# Altium schematic sheet [2]TSAL.SchDoc
size A4; SheetNumber: 4; SheetTotal: 7
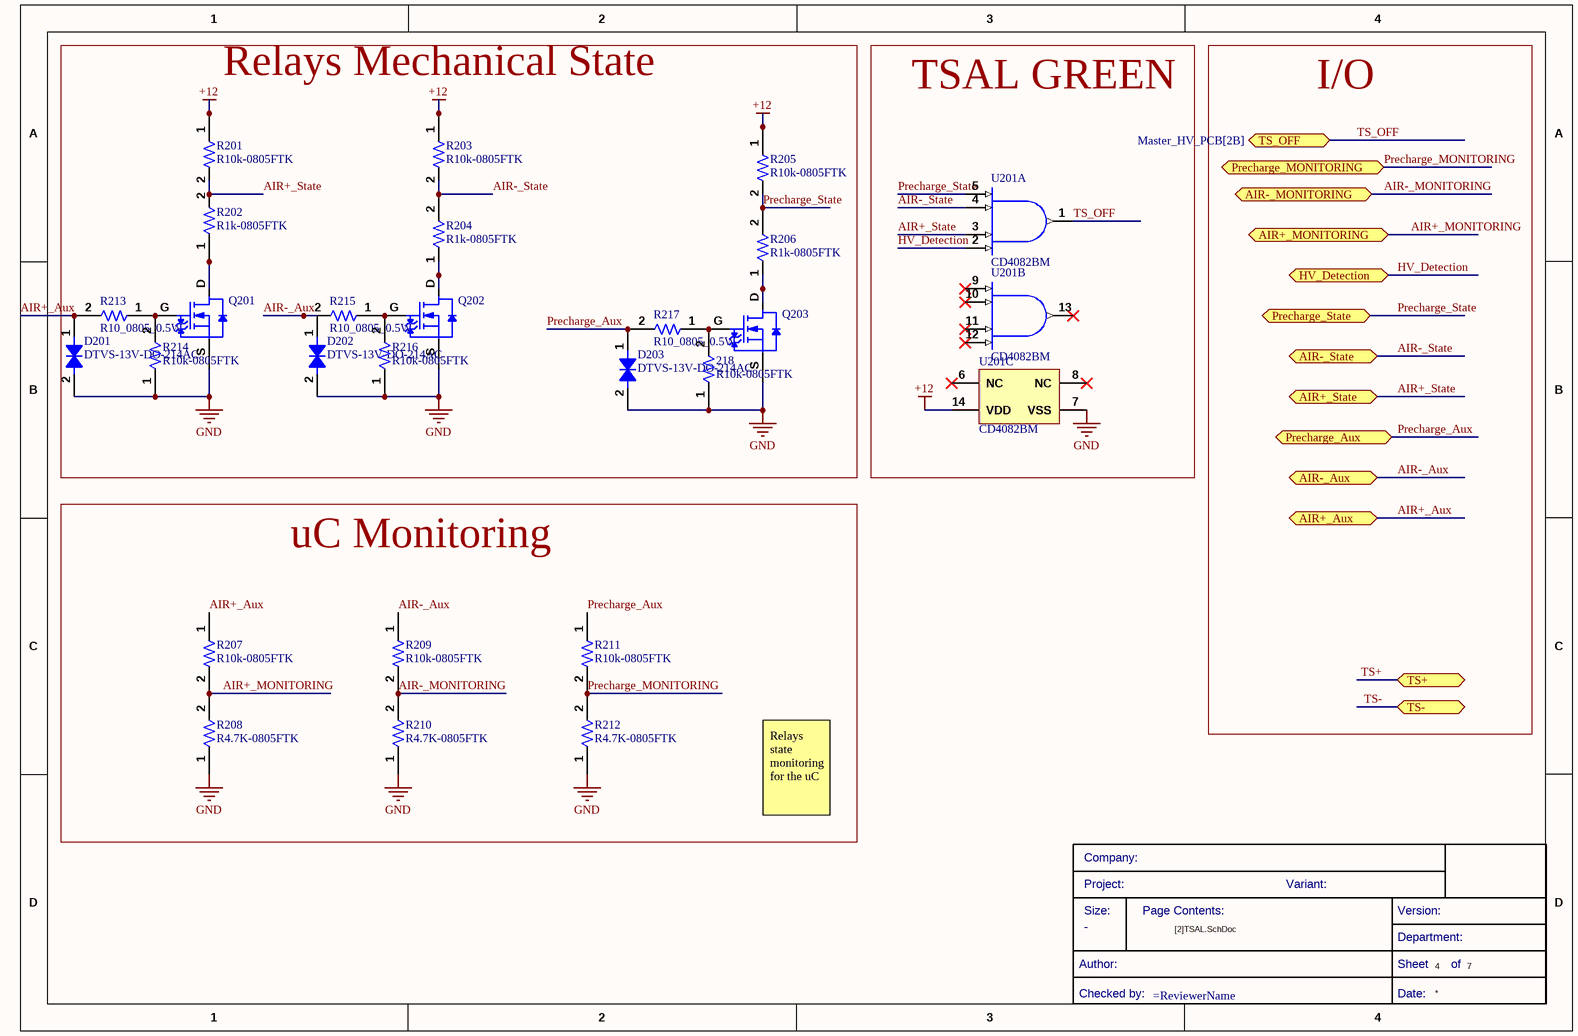
[diagram p0: [2]TSAL.SchDoc]

## Parts
218  R10k-0805FTK  [R0805FTK]
?  (no value)  (graphical)
D201  DTVS-13V-DO-214AC  [DTVS-DO-214AC]
D202  DTVS-13V-DO-214AC  [DTVS-DO-214AC]
D203  DTVS-13V-DO-214AC  [DTVS-DO-214AC]
Q201  SQ2362ES-T1_BE3  [SOT95P245X110-3N]  (value not drawn)
Q202  SQ2362ES-T1_BE3  [SOT95P245X110-3N]  (value not drawn)
Q203  SQ2362ES-T1_BE3  [SOT95P245X110-3N]  (value not drawn)
R201  R10k-0805FTK  [R0805FTK]
R202  R1k-0805FTK  [R0805FTK]
R203  R10k-0805FTK  [R0805FTK]
R204  R1k-0805FTK  [R0805FTK]
R205  R10k-0805FTK  [R0805FTK]
R206  R1k-0805FTK  [R0805FTK]
R207  R10k-0805FTK  [R0805FTK]
R208  R4.7K-0805FTK  [R0805FTK]
R209  R10k-0805FTK  [R0805FTK]
R210  R4.7K-0805FTK  [R0805FTK]
R211  R10k-0805FTK  [R0805FTK]
R212  R4.7K-0805FTK  [R0805FTK]
R213  R10_0805_0.5W  [0805]
R214  R10k-0805FTK  [R0805FTK]
R215  R10_0805_0.5W  [0805]
R216  R10k-0805FTK  [R0805FTK]
R217  R10_0805_0.5W  [0805]
U201  CD4082BM  [D0014A_N]  (parts A,B,C of 3)

## Blocks framed on the sheet
Relays Mechanical State: 218 D201-D203 Q201-Q203 R201-R206 R213-R217
TSAL GREEN: U201
uC Monitoring: R207-R212

## Ports
AIR+_Aux (bidir, see Master_HV_PCB[1B]), AIR+_MONITORING (bidir, see Master_HV_PCB[2B]), AIR+_State (bidir, see Master_HV_PCB[1B]), AIR-_Aux (bidir, see Master_HV_PCB[1B]), AIR-_MONITORING (bidir, see Master_HV_PCB[2B]), AIR-_State (bidir, see Master_HV_PCB[1C]), HV_Detection (bidir, see Master_HV_PCB[1B], [3]HV_Detection[4A]), Precharge_Aux (bidir, see Master_HV_PCB[1B]), Precharge_MONITORING (bidir, see Master_HV_PCB[2B]), Precharge_State (bidir, see Master_HV_PCB[1C]), TS+ (bidir, see Master_HV_PCB[1B], [3]HV_Detection[4B], [6]Accumulator_Indicator[3A]), TS- (bidir, see Master_HV_PCB[1B], [3]HV_Detection[4B], [6]Accumulator_Indicator[3A]), TS_OFF (bidir, see Master_HV_PCB[2B])

## Nets
+12: R201.1 R203.1 R205.1 U201.14(VDD)
GND: 218.1 D201.2 D202.2 D203.2 Q201.S Q202.S Q203.S R208.1 R210.1 R212.1 R214.1 R216.1 U201.7(VSS)
AIR+_Aux: D201.1 R207.1 R213.2 ; port AIR+_Aux
AIR+_MONITORING: R207.2 R208.2 ; port AIR+_MONITORING
AIR+_State: R201.2 R202.2 U201.3(C) ; port AIR+_State
AIR-_Aux: D202.1 R209.1 R215.2 ; port AIR-_Aux
AIR-_MONITORING: R209.2 R210.2 ; port AIR-_MONITORING
AIR-_State: R203.2 R204.2 U201.4(B) ; port AIR-_State
HV_Detection: U201.2(D) ; port HV_Detection
Precharge_Aux: D203.1 R211.1 R217.2 ; port Precharge_Aux
Precharge_MONITORING: R211.2 R212.2 ; port Precharge_MONITORING
Precharge_State: R205.2 R206.2 U201.5(A) ; port Precharge_State
TS+: port TS+
TS-: port TS-
TS_OFF: U201.1(J) ; port TS_OFF
Net218_2: 218.2 Q203.G R217.1
NetQ201_D: Q201.D R202.1
NetQ201_G: Q201.G R213.1 R214.2
NetQ202_D: Q202.D R204.1
NetQ202_G: Q202.G R215.1 R216.2
NetQ203_D: Q203.D R206.1

Not connected (* = marked no-connect by the designer): U201 6(NC)* 8(NC)* 9(E)* 10(F)* 11(G)* 12(H)* 13(K)*

## Notes on the sheet
- I/O
- Relays state monitoring for the uC
- Size:
- Company:
- Project:
- Page Contents:
- Variant:
- Version:
- Checked by:
- Author:
- Sheet
- Date:
- Department:
- of

## Library data of the parts
218 R214 R216 = CMP-00085-4: BOURNS         CR0805-JW-103ELF            Surface Mount Chip Resistor, Thick Film, CR Series, 10 kohm, 125 mW,  5%, 150 V; Voltage Rating: 150V; Voltage Rating (DC): 100V; Max Power Dissipation: 125mW; Temperature Coefficient: 200ppm/°C; Value: 10k; .Creator: DR; Depth: 1.25mm; Package Quantity: 1; ComponentLink6Description: https://datasheet.ciiva.com/16783/70154685-16783482.pdf?src-supplier=Allied+Electronics; Max Operating Temperature: 155°C; ComponentLink8Description: https://datasheet.ciiva.com/6559/chpreztr-6559900.pdf?src-supplier=Digi-Key; ComponentLink3URL: https://datasheet.ciiva.com/22693/1902866-22693254.pdf?src-supplier=Element14; ComponentLink2URL: https://datasheet.ciiva.com/9122/chpreztr-9122374.pdf?src-supplier=Avnet; REACH SVHC: No SVHC; ComponentLink9Description: https://datasheet.ciiva.com/6559/chpreztr-6559901.pdf?src-supplier=Digi-Key; ComponentLink1URL: https://datasheet.ciiva.com/11821/0900766b80fcdb72-11821135.pdf?src-supplier=RSComponents; Manufacturer Part Number 1: CR0805-JW-103ELF; ComponentLink8URL: https://datasheet.ciiva.com/6559/chpreztr-6559900.pdf?src-supplier=Digi-Key; Length: 2mm; ComponentLink10Description: https://datasheet.ciiva.com/7985/1856384-7985869.pdf?src-supplier=Element14; Case/Package: 0805; ComponentLink5Description: https://datasheet.ciiva.com/30065/159chpreztr-30065976.pdf?src-supplier=Onlinecomponents.com; Design Item ID: R10k-0805FTK; ComponentLink1Description: https://datasheet.ciiva.com/11821/0900766b80fcdb72-11821135.pdf?src-supplier=RSComponents; Number of Terminations: 2; Radiation Hardening: No; Resistance Tolerance: 5%; ComponentLink4Description: https://datasheet.ciiva.com/7986/691949-7986187.pdf?src-supplier=Element14; ComponentLink3Description: https://datasheet.ciiva.com/22693/1902866-22693254.pdf?src-supplier=Element14; Packaging: Tape and Reel; ComponentLink6URL: https://datasheet.ciiva.com/16783/70154685-16783482.pdf?src-supplier=Allied+Electronics; Pins: 2; ComponentLink5URL: https://datasheet.ciiva.com/30065/159chpreztr-30065976.pdf?src-supplier=Onlinecomponents.com; Mount: Surface Mount; ComponentLink11URL: https://datasheet.ciiva.com/48692/001055517-da-01-en-smd-wid-cr0805-jw-103elf-10k-ohm-1-8w-48692118.pdf?src-supplier=Conrad; ComponentLink11Description: https://datasheet.ciiva.com/48692/001055517-da-01-en-smd-wid-cr0805-jw-103elf-10k-ohm-1-8w-48692118.pdf?src-supplier=Conrad; Military Standard: Not; Power Rating: 125mW; Thickness: 508um; Source: Passives.SchLib; Min Operating Temperature: -55°C; Manufacturer 1: Bourns; Resistor Type: Thick Film; ComponentLink7URL: https://datasheet.ciiva.com/5548/chpreztr-5548491.pdf?src-supplier=Mouser; ComponentLink2Description: https://datasheet.ciiva.com/9122/chpreztr-9122374.pdf?src-supplier=Avnet; Termination: SMD/SMT; Features: Moisture Resistant; ComponentLink4URL: https://datasheet.ciiva.com/7986/691949-7986187.pdf?src-supplier=Element14; RoHS Compliant: Yes; ComponentLink9URL: https://datasheet.ciiva.com/6559/chpreztr-6559901.pdf?src-supplier=Digi-Key; Technology: THICK FILM; ComponentLink10URL: https://datasheet.ciiva.com/7985/1856384-7985869.pdf?src-supplier=Element14; Height: 0.5mm; Category: Chip SMD Resistors; RoHS: Yes; Series: CR0805; Pricing 1: 1=0,05790, 10=0,01540, 25=0,01340, 100=0,00340 (USD); Stock 1: 57566; ComponentLink7Description: https://datasheet.ciiva.com/5548/chpreztr-5548491.pdf?src-supplier=Mouser; Case Code (Metric): 2012; Contact Plating: Tin; Tolerance: 5%; Construction: Rectangular; Width: 1.25mm
? = CMP-00043-6: Standard Title Block
D201-D203 = CMP-00155-1: Tvs Diode, 400W, 13V, Bidir, DO-214AC; Manufacturer Part Number: 824501131; Manufacturer: Wurth Electronics; Peak Pulse Current: 18.6A; Power Line Protection: No; .Creator: DO; Forward Voltage: 15.15V; Polarity: Bidirectional; Number of Bidirectional Channels: 1; Clamping Voltage: 21.5V; Max Operating Temperature: 150°C; Category: TVS Diodes; Stock 1: 1000; RoHS: Yes; ComponentLink3Description: Where buy it; Source: Filter components.SchLib; Design Item ID: DTVS-13V-DO-214AC; REACH SVHC: Unknown; Min Operating Temperature: -65°C; Resistor Type: Zener; ComponentLink2Description: http://www.farnell.com/datasheets/2036399.pdf?src-supplier=Element14; Peak Pulse Power: 400W; ComponentLink1URL: https://katalog.we-online.de/pbs/datasheet/824501131.pdf?src-supplier=Digi-Key; Packaging: Cut Tape; ComponentLink2URL: http://www.farnell.com/datasheets/2036399.pdf?src-supplier=Element14; ComponentLink3URL: https://www.we-online.com/catalog/en/WE-TVSP?sq=824501131#824501131; RoHS Compliant: Yes; Reverse Standoff Voltage: 13V; Mount: Surface Mount; Min Breakdown Voltage: 15.15V; ComponentLink1Description: https://katalog.we-online.de/pbs/datasheet/824501131.pdf?src-supplier=Digi-Key; Pricing 1: 1=0,27000 (USD); Pins: 2
Q201-Q203 = CMP-013-00001-1: Small Signal Field-Effect Transistor; RoHS Compliant: Yes
R201 R203 R205 R207 R209 R211 = CMP-00085-1: BOURNS         CR0805-JW-103ELF            Surface Mount Chip Resistor, Thick Film, CR Series, 10 kohm, 125 mW,  5%, 150 V; .Creator: DR; Power Rating: 125mW; Voltage Rating (DC): 100V; Voltage Rating: 150V; Temperature Coefficient: 200ppm/°C; Value: 10k; ComponentLink6URL: https://datasheet.ciiva.com/16783/70154685-16783482.pdf?src-supplier=Allied+Electronics; Manufacturer 1: Bourns; Package Quantity: 1; ComponentLink10URL: https://datasheet.ciiva.com/7985/1856384-7985869.pdf?src-supplier=Element14; Technology: THICK FILM; Source: Passives.SchLib; RoHS Compliant: Yes; ComponentLink10Description: https://datasheet.ciiva.com/7985/1856384-7985869.pdf?src-supplier=Element14; ComponentLink1URL: https://datasheet.ciiva.com/11821/0900766b80fcdb72-11821135.pdf?src-supplier=RSComponents; ComponentLink7Description: https://datasheet.ciiva.com/5548/chpreztr-5548491.pdf?src-supplier=Mouser; Radiation Hardening: No; Design Item ID: R10k-0805FTK; ComponentLink4Description: https://datasheet.ciiva.com/7986/691949-7986187.pdf?src-supplier=Element14; Pins: 2; ComponentLink9URL: https://datasheet.ciiva.com/6559/chpreztr-6559901.pdf?src-supplier=Digi-Key; Resistor Type: Thick Film; ComponentLink4URL: https://datasheet.ciiva.com/7986/691949-7986187.pdf?src-supplier=Element14; Contact Plating: Tin; Case Code (Metric): 2012; Military Standard: Not; Depth: 1.25mm; Case/Package: 0805; Packaging: Tape and Reel; ComponentLink9Description: https://datasheet.ciiva.com/6559/chpreztr-6559901.pdf?src-supplier=Digi-Key; Construction: Rectangular; Pricing 1: 1=0,05790, 10=0,01540, 25=0,01340, 100=0,00340 (USD); ComponentLink7URL: https://datasheet.ciiva.com/5548/chpreztr-5548491.pdf?src-supplier=Mouser; Category: Chip SMD Resistors; Length: 2mm; Max Operating Temperature: 155°C; Resistance Tolerance: 5%; Manufacturer Part Number 1: CR0805-JW-103ELF; Height: 0.5mm; ComponentLink2URL: https://datasheet.ciiva.com/9122/chpreztr-9122374.pdf?src-supplier=Avnet; Thickness: 508um; Max Power Dissipation: 125mW; ComponentLink8Description: https://datasheet.ciiva.com/6559/chpreztr-6559900.pdf?src-supplier=Digi-Key; REACH SVHC: No SVHC; ComponentLink8URL: https://datasheet.ciiva.com/6559/chpreztr-6559900.pdf?src-supplier=Digi-Key; ComponentLink5URL: https://datasheet.ciiva.com/30065/159chpreztr-30065976.pdf?src-supplier=Onlinecomponents.com; Width: 1.25mm; ComponentLink11URL: https://datasheet.ciiva.com/48692/001055517-da-01-en-smd-wid-cr0805-jw-103elf-10k-ohm-1-8w-48692118.pdf?src-supplier=Conrad; ComponentLink3Description: https://datasheet.ciiva.com/22693/1902866-22693254.pdf?src-supplier=Element14; ComponentLink11Description: https://datasheet.ciiva.com/48692/001055517-da-01-en-smd-wid-cr0805-jw-103elf-10k-ohm-1-8w-48692118.pdf?src-supplier=Conrad; ComponentLink1Description: https://datasheet.ciiva.com/11821/0900766b80fcdb72-11821135.pdf?src-supplier=RSComponents; ComponentLink2Description: https://datasheet.ciiva.com/9122/chpreztr-9122374.pdf?src-supplier=Avnet; Stock 1: 57566; Min Operating Temperature: -55°C; Series: CR0805; Number of Terminations: 2; Termination: SMD/SMT; Tolerance: 5%; Mount: Surface Mount; ComponentLink6Description: https://datasheet.ciiva.com/16783/70154685-16783482.pdf?src-supplier=Allied+Electronics; ComponentLink5Description: https://datasheet.ciiva.com/30065/159chpreztr-30065976.pdf?src-supplier=Onlinecomponents.com; RoHS: Yes; Features: Moisture Resistant; ComponentLink3URL: https://datasheet.ciiva.com/22693/1902866-22693254.pdf?src-supplier=Element14
R202 R204 R206 = CMP-00076-1: Res Thick Film 0805 1K Ohm 5% 1/8W ±200ppm/°C Molded SMD SMD Paper Tape on Plastic Reel; Manufacturer Part Number 1: CR0805-JW-102ELF; Manufacturer 1: Bourns; Voltage Rating (DC): 150V; Power Rating: 125mW; .Creator: GP; Number of Terminations: 2; REACH SVHC: No SVHC; ComponentLink3URL: https://datasheet.ciiva.com/22693/1902866-22693253.pdf?src-supplier=Element14; ComponentLink1URL: https://datasheet.ciiva.com/11821/0900766b80fcdb72-11821134.pdf?src-supplier=RSComponents; ComponentLink1Description: https://datasheet.ciiva.com/11821/0900766b80fcdb72-11821134.pdf?src-supplier=RSComponents; Category: Chip SMD Resistors; Stock 1: 27510; Case/Package: 0805; ComponentLink3Description: https://datasheet.ciiva.com/22693/1902866-22693253.pdf?src-supplier=Element14; Length: 2mm; ComponentLink5URL: https://datasheet.ciiva.com/7985/1856384-7985867.pdf?src-supplier=Element14; ComponentLink7Description: https://datasheet.ciiva.com/6547/chpreztr-6547359.pdf?src-supplier=Digi-Key; Package Quantity: 1; Tolerance: 5%; Lead Free: Lead Free; RoHS: Yes; Contact Plating: Tin; ComponentLink2Description: https://datasheet.ciiva.com/15225/getdatasheetpartid-78155-15225381.pdf?src-supplier=Verical; ComponentLink5Description: https://datasheet.ciiva.com/7985/1856384-7985867.pdf?src-supplier=Element14; Depth: 1.25mm; Thickness: 508um; Resistor Type: Thick Film; Design Item ID: R1k-0805FTK; ComponentLink2URL: https://datasheet.ciiva.com/15225/getdatasheetpartid-78155-15225381.pdf?src-supplier=Verical; Max Operating Temperature: 155°C; ComponentLink6URL: https://datasheet.ciiva.com/30242/159chpreztr-30242765.pdf?src-supplier=Onlinecomponents.com; ComponentLink4URL: https://datasheet.ciiva.com/7986/1856384-7986184.pdf?src-supplier=Element14; Military Standard: Not; Case Code (Metric): 2012; Temperature Coefficient: 200ppm/°C; Pricing 1: 1=0,05930, 10=0,03510, 25=0,01790, 100=0,00800, 250=0,00790, 500=0,00590, 1000=0,00360, 3000=0,00350, 6000=0,00250 (USD); Min Operating Temperature: -55°C; ComponentLink7URL: https://datasheet.ciiva.com/6547/chpreztr-6547359.pdf?src-supplier=Digi-Key; Width: 1.25mm; Source: Passives.SchLib; Max Power Dissipation: 125mW; Voltage Rating: 150V; ComponentLink4Description: https://datasheet.ciiva.com/7986/1856384-7986184.pdf?src-supplier=Element14; Features: Moisture Resistant; Mount: Surface Mount; Termination: SMD/SMT; Value: 1k; Height: 0.5mm; Radiation Hardening: No; ComponentLink6Description: https://datasheet.ciiva.com/30242/159chpreztr-30242765.pdf?src-supplier=Onlinecomponents.com; Pins: 2; Packaging: Tape and Reel
R208 R210 R212 = CMP-00102-1: Res Thick Film 0805 4.7K Ohm 5% 1/8W ±200ppm/°C Molded SMD SMD Paper Tape on Plastic Reel; Manufacturer Part Number 1: CR0805-JW-472ELF; Manufacturer 1: Bourns; Max Power Dissipation: 125mW; .Creator: DR; Voltage Rating (DC): 150V; ComponentLink5URL: https://datasheet.ciiva.com/9122/chpreztr-9122814.pdf?src-supplier=Avnet; ComponentLink2URL: https://datasheet.ciiva.com/6560/chpreztr-6560073.pdf?src-supplier=Digi-Key; Depth: 1.25mm; ComponentLink7URL: https://datasheet.ciiva.com/6560/chpreztr-6560075.pdf?src-supplier=Digi-Key; Radiation Hardening: No; ComponentLink5Description: https://datasheet.ciiva.com/9122/chpreztr-9122814.pdf?src-supplier=Avnet; Construction: Rectangular; Case/Package: 0805; Design Item ID: R4.7K-0805FTK; RoHS Compliant: Yes; Min Operating Temperature: -55°C; Height: 0.024inch; ComponentLink1Description: https://datasheet.ciiva.com/5541/chpreztr-5541593.pdf?src-supplier=Mouser; Series: CR0805; Packaging: Tape and Reel; Width: 0.049inch; Stock 1: 3734; ComponentLink3URL: https://datasheet.ciiva.com/6560/chpreztr-6560074.pdf?src-supplier=Digi-Key; ComponentLink4URL: https://datasheet.ciiva.com/30174/159chpreztr-30174252.pdf?src-supplier=Onlinecomponents.com; Value: 4.7k; Military Standard: Not; Tolerance: 5%; Voltage Rating: 150V; ComponentLink6Description: https://datasheet.ciiva.com/22713/691949-22713272.pdf?src-supplier=Element14; REACH SVHC: No SVHC; Package Quantity: 1; Termination: SMD/SMT; ComponentLink1URL: https://datasheet.ciiva.com/5541/chpreztr-5541593.pdf?src-supplier=Mouser; ComponentLink4Description: https://datasheet.ciiva.com/30174/159chpreztr-30174252.pdf?src-supplier=Onlinecomponents.com; Resistor Type: Thick Film; Length: 2mm; Case Code (Metric): 2012; Category: Chip SMD Resistors; Resistance Tolerance: 5%; Thickness: 508um; ComponentLink6URL: https://datasheet.ciiva.com/22713/691949-22713272.pdf?src-supplier=Element14; Features: Moisture Resistant; Power Rating: 125mW; RoHS: Yes; Mount: Surface Mount; ComponentLink7Description: https://datasheet.ciiva.com/6560/chpreztr-6560075.pdf?src-supplier=Digi-Key; Number of Terminations: 2; Source: Passives.SchLib; Temperature Coefficient: 200ppm/°C; Max Operating Temperature: 155°C; ComponentLink3Description: https://datasheet.ciiva.com/6560/chpreztr-6560074.pdf?src-supplier=Digi-Key; ComponentLink2Description: https://datasheet.ciiva.com/6560/chpreztr-6560073.pdf?src-supplier=Digi-Key; Pricing 1: 1=0,05590, 10=0,01670, 25=0,01290, 100=0,00840, 250=0,00830, 500=0,00690, 1000=0,00410 (USD); Contact Plating: Tin
R213 R215 R217 = CMP-009-00031-1: Fixed Resistor, Metal Glaze/thick Film, 0.5W, 10ohm, 150V, 1% +/-Tol, 100ppm/Cel, Surface Mount, 0805; Power: 500mW; Value: 10; Tolerance: 1%; Max Operating Temperature: 155°C; RoHS Compliant: Yes; Case/Package: 0805; Min Operating Temperature: -55°C; Mounting Technology: Surface Mount; Pins: 2
U201 = CMP-00218-1: AND Gate, 4000/14000/40000 Series, 2-Func, 4-Input, CMOS, PDSO14; Min Supply Voltage: 3V; Schmitt Trigger: No; Package Equivalence Code: SOP14,.25; Power Supplies: 5/15V; Channels: 2; Propagation Delay (tpd): 250ns; Max Supply Voltage: 18V; Nominal Supply Voltage: 5V; Number of Inputs: 4; Load Capacitance (CL): 50pF; Package Body Material: Plastic; Qualification Status: Not Qualified; Load/Preset Input: Yes; Moisture Sensitivity Level: 1; Terminal Position: DUAL; Logic Type: AND GATE; Terminal Pitch: 1.27mm; Width: 3.9mm; Length: 8.65mm; Min Operating Temperature: -55°C; Height - Seated (Max): 1.75mm; Reach SVHC Compliant: Yes; JESD-30 Code: R-PDSO-G14; RoHS Compliant: Yes; Package Shape: Rectangular; JESD-609 Code: e4; Prop. Delay@Nom-Sup: 250ns; Packaging: Rail/Tube; Peak Reflow Temperature (Cel): 260°C; Terminal Finish: Nickel; Case/Package: SOP; Technology: CMOS; Terminal Form: Gull Wing; Surface Mount: Yes; Temperature Grade: MILITARY; Package Style: SMALL OUTLINEMeter; Pins: 14; Max Operating Temperature: 125°C